# Altium schematic sheet mcu_mic_amp_connector.SchDoc
size A4
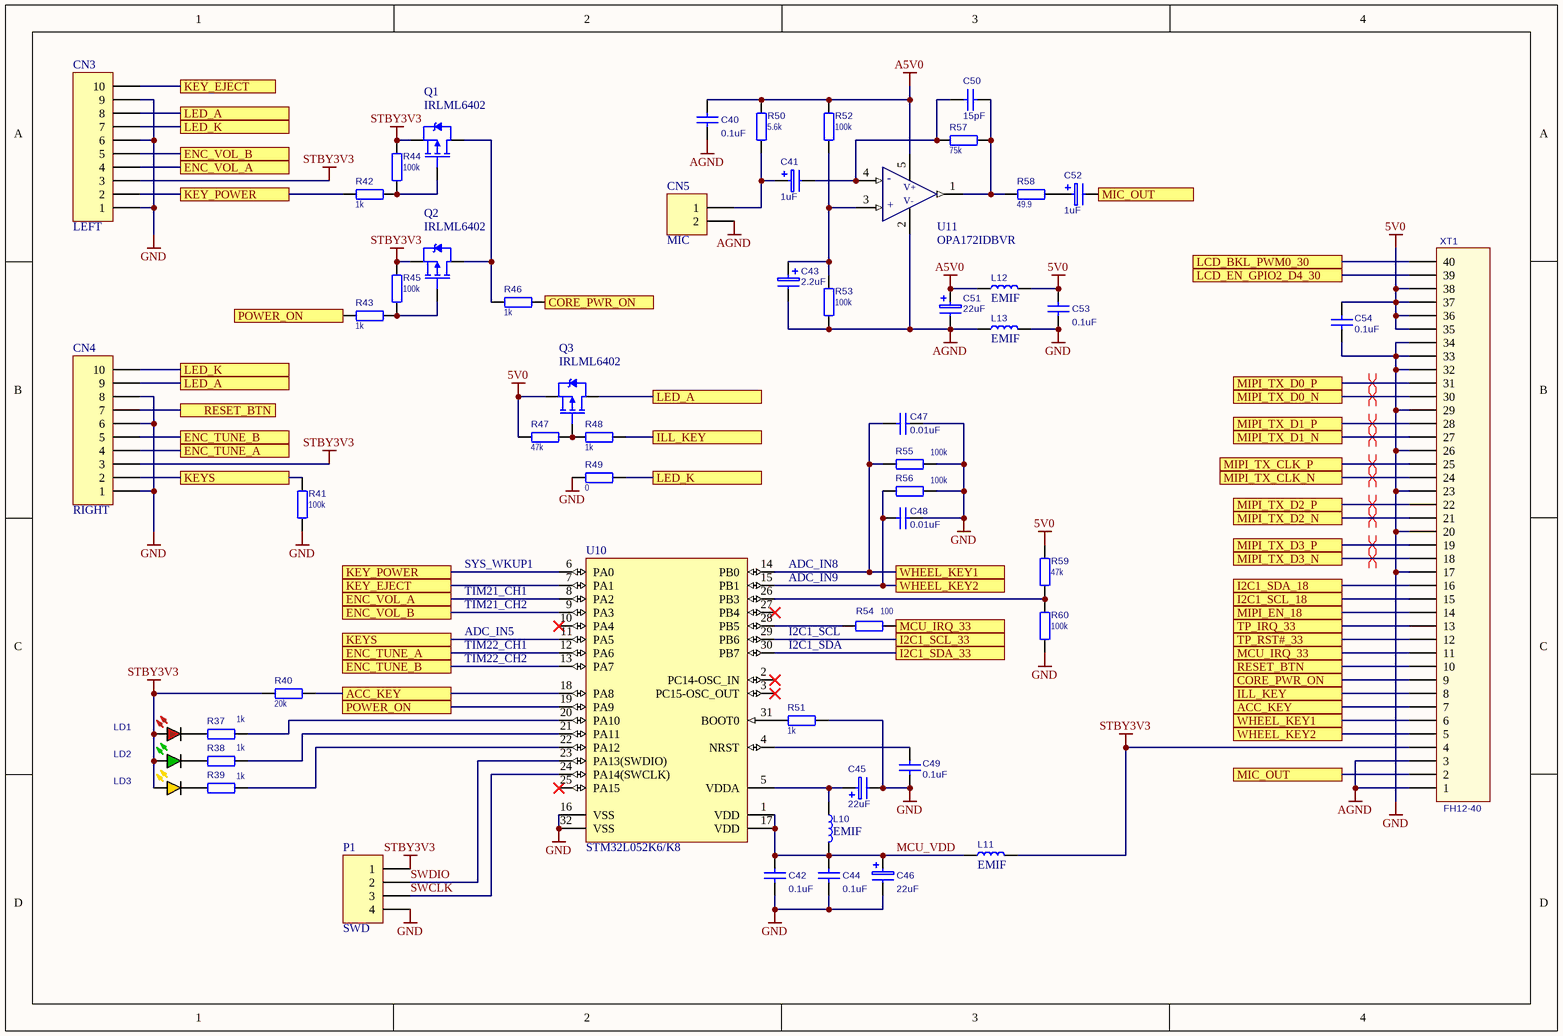
[diagram p0: mcu_mic_amp_connector.SchDoc]

## Parts
C40  value 0.1uF  [C0603]  (hidden comment: CC0603KRX7R9BB104)
C41  value 1uF  [TANTAL-A-1206]  (hidden comment: 293D105X9035A2TE3)
C42  value 0.1uF  [C0603]  (hidden comment: CC0603KRX7R9BB104)
C43  value 2.2uF  [TANTAL-A-1206]  (hidden comment: 293D225X9010A2TE3)
C44  value 0.1uF  [C0603]  (hidden comment: CC0603KRX7R9BB104)
C45  value 22uF  [TANTAL-A-1206]  (hidden comment: 293D226X9010A2TE3)
C46  value 22uF  [TANTAL-A-1206]  (hidden comment: 293D226X9010A2TE3)
C47  value 0.01uF  [C0603]  (hidden comment: CL10B103KB8NNNC)
C48  value 0.01uF  [C0603]  (hidden comment: CL10B103KB8NNNC)
C49  value 0.1uF  [C0603]  (hidden comment: CC0603KRX7R9BB104)
C50  value 15pF  [C0603]  (hidden comment: CC0603GRNPO9BN150)
C51  value 22uF  [TANTAL-A-1206]  (hidden comment: 293D226X9010A2TE3)
C52  value 1uF  [TANTAL-A-1206]  (hidden comment: 293D105X9035A2TE3)
C53  value 0.1uF  [C0603]  (hidden comment: CC0603KRX7R9BB104)
C54  value 0.1uF  [C0603]  (hidden comment: C1608X7R1H104K080AA)
CN3  LEFT  [10S-0.5SH]
CN4  RIGHT  [10S-0.5SH]
CN5  MIC  [MW-2M]
L10  value EMIF  [IND0603]  (hidden comment: BLM18AG102SN1D)
L11  value EMIF  [IND0603]  (hidden comment: BLM18AG102SN1D)
L12  value EMIF  [IND0603]  (hidden comment: BLM18AG102SN1D)
L13  value EMIF  [IND0603]  (hidden comment: BLM18AG102SN1D)
LD1  FYLS-0603URC  [LED0603]  (value not drawn)
LD2  KPT-1608SGC  [LED0603]  (value not drawn)
LD3  FYLS-0603UYC  [LED0603]  (value not drawn)
P1  SWD  [PLS-4]
Q1  IRLML6402  [SOT-23-3]
Q2  IRLML6402  [SOT-23-3]
Q3  IRLML6402  [SOT-23-3]
R37  1k  [R0603]
R38  1k  [R0603]
R39  1k  [R0603]
R40  20k  [R0603]
R41  100k  [R0603]
R42  1k  [R0603]
R43  1k  [R0603]
R44  100k  [R0603]
R45  100k  [R0603]
R46  1k  [R0603]
R47  47k  [R0603]
R48  1k  [R0603]
R49  0  [R0805]
R50  5.6k  [R0603]
R51  1k  [R0603]
R52  100k  [R0603]
R53  100k  [R0603]
R54  100  [R0603]
R55  100k  [R0603]
R56  100k  [R0603]
R57  75k  [R0603]
R58  49.9  [R0603]
R59  47k  [R0603]
R60  100k  [R0603]
U10  STM32L052K6/K8  [STM-LQFP32_N]
U11  OPA172IDBVR  [SOT-23-5]
XT1  FH12-40  [40S-0.5SH]

## Ports
ACC_KEY, CORE_PWR_ON, ENC_TUNE_A, ENC_TUNE_B, ENC_VOL_A, ENC_VOL_B, I2C1_SCL_18, I2C1_SCL_33, I2C1_SDA_18, I2C1_SDA_33, ILL_KEY, KEY_EJECT, KEY_POWER, KEYS, LCD_BKL_PWM0_30, LCD_EN_GPIO2_D4_30, LED_A, LED_K, MCU_IRQ_33, MIC_OUT, MIPI_EN_18, MIPI_TX_CLK_N, MIPI_TX_CLK_P, MIPI_TX_D0_N, MIPI_TX_D0_P, MIPI_TX_D1_N, MIPI_TX_D1_P, MIPI_TX_D2_N, MIPI_TX_D2_P, MIPI_TX_D3_N, MIPI_TX_D3_P, POWER_ON, RESET_BTN, TP_IRQ_33, TP_RST#_33, WHEEL_KEY1, WHEEL_KEY2

## Nets
5V0: C53.1 C54.2 L12.2 Q3.2(S) R47.1 R59.2 XT1.35 XT1.36 XT1.37 XT1.38
A5V0: C40.1 C51.1(+) L12.1 R50.1 R52.1 U11.5(V+)
AGND: C40.2 C43.2(-) C51.2(-) CN5.2 L13.1 R53.2 U11.2(V-) XT1.1 XT1.3
GND: C42.2 C44.2 C45.2(-) C46.2(-) C47.1 C48.1 C49.1 C53.2 C54.1 CN3.1 CN3.6 CN3.9 CN4.1 CN4.6 CN4.8 L13.2 P1.4 R41.1 R49.1 R51.2 R55.2 R56.2 R60.2 U10.16(VSS) U10.32(VSS) XT1.17 XT1.20 XT1.23 XT1.26 XT1.29 XT1.32 XT1.33 XT1.34
STBY3V3: CN3.3 CN4.3 L11.2 LD1.2 LD2.2 LD3.2 P1.1 Q1.2(S) Q2.2(S) R40.2 R44.2 R45.2 XT1.4
ACC_KEY: R40.1 U10.18(PA8) XT1.7 ; port ACC_KEY
CORE_PWR_ON: R46.1 XT1.9 ; port CORE_PWR_ON
ENC_TUNE_A: CN4.4 U10.12(PA6) ; port ENC_TUNE_A
ENC_TUNE_B: CN4.5 U10.13(PA7) ; port ENC_TUNE_B
ENC_VOL_A: CN3.4 U10.8(PA2) ; port ENC_VOL_A
ENC_VOL_B: CN3.5 U10.9(PA3) ; port ENC_VOL_B
I2C1_SCL_18: XT1.15 ; port I2C1_SCL_18
I2C1_SCL_33: U10.29(PB6) ; port I2C1_SCL_33
I2C1_SDA_18: XT1.16 ; port I2C1_SDA_18
I2C1_SDA_33: U10.30(PB7) ; port I2C1_SDA_33
ILL_KEY: R48.2 XT1.8 ; port ILL_KEY
KEY_EJECT: CN3.10 U10.7(PA1) ; port KEY_EJECT
KEY_POWER: CN3.2 R42.1 U10.6(PA0) ; port KEY_POWER
KEYS: CN4.2 R41.2 U10.11(PA5) ; port KEYS
LCD_BKL_PWM0_30: XT1.40 ; port LCD_BKL_PWM0_30
LCD_EN_GPIO2_D4_30: XT1.39 ; port LCD_EN_GPIO2_D4_30
LED_A: CN3.8 CN4.9 Q3.3(D) ; port LED_A
LED_K: CN3.7 CN4.10 R49.2 ; port LED_K
MCU_IRQ_33: R54.2 XT1.11 ; port MCU_IRQ_33
MCU_VDD: C42.1 C44.1 C46.1(+) L10.2 L11.1 U10.1(VDD) U10.17(VDD)
MIC_OUT: C52.2(-) XT1.2 ; port MIC_OUT
MIPI_EN_18: XT1.14 ; port MIPI_EN_18
MIPI_TX_CLK_N: XT1.24 ; port MIPI_TX_CLK_N
MIPI_TX_CLK_P: XT1.25 ; port MIPI_TX_CLK_P
MIPI_TX_D0_N: XT1.30 ; port MIPI_TX_D0_N
MIPI_TX_D0_P: XT1.31 ; port MIPI_TX_D0_P
MIPI_TX_D1_N: XT1.27 ; port MIPI_TX_D1_N
MIPI_TX_D1_P: XT1.28 ; port MIPI_TX_D1_P
MIPI_TX_D2_N: XT1.21 ; port MIPI_TX_D2_N
MIPI_TX_D2_P: XT1.22 ; port MIPI_TX_D2_P
MIPI_TX_D3_N: XT1.18 ; port MIPI_TX_D3_N
MIPI_TX_D3_P: XT1.19 ; port MIPI_TX_D3_P
POWER_ON: R43.2 U10.19(PA9) ; port POWER_ON
RESET_BTN: CN4.7 XT1.10 ; port RESET_BTN
SWCLK: P1.3 U10.24(PA14(SWCLK))
SWDIO: P1.2 U10.23(PA13(SWDIO))
TP_IRQ_33: XT1.13 ; port TP_IRQ_33
TP_RST#_33: XT1.12 ; port TP_RST#_33
WHEEL_KEY1: C47.2 R55.1 U10.14(PB0) XT1.6 ; port WHEEL_KEY1
WHEEL_KEY2: C48.2 R56.1 U10.15(PB1) XT1.5 ; port WHEEL_KEY2
NetC41_1: C41.1(+) CN5.1 R50.2
NetC41_2: C41.2(-) C50.1 R57.2 U11.4(-)
NetC43_1: C43.1(+) R52.2 R53.1 U11.3(+)
NetC45_1: C45.1(+) L10.1 U10.5(VDDA)
NetC49_2: C49.2 U10.4(NRST)
NetC50_2: C50.2 R57.1 R58.1 U11.1
NetC52_1: C52.1(+) R58.2
NetLD1_1: LD1.1 R37.1
NetLD2_1: LD2.1 R38.1
NetLD3_1: LD3.1 R39.1
NetQ1_1: Q1.1(G) R42.2 R44.1
NetQ1_3: Q1.3(D) Q2.3(D) R46.2
NetQ2_1: Q2.1(G) R43.1 R45.1
NetQ3_1: Q3.1(G) R47.2 R48.1
NetR37_2: R37.2 U10.20(PA10)
NetR38_2: R38.2 U10.21(PA11)
NetR39_2: R39.2 U10.22(PA12)
NetR51_1: R51.1 U10.31(BOOT0)
NetR54_1: R54.1 U10.28(PB5)
NetR59_1: R59.1 R60.1 U10.26(PB3)

Not connected (* = marked no-connect by the designer): U10 2(PC14-OSC_IN)* 3(PC15-OSC_OUT)* 10(PA4)* 25(PA15)* 27(PB4)*

## Layout directives
differential pair: MIPI_TX_CLK_N, MIPI_TX_CLK_P, MIPI_TX_D0_N, MIPI_TX_D0_P, MIPI_TX_D1_N, MIPI_TX_D1_P, MIPI_TX_D2_N, MIPI_TX_D2_P, MIPI_TX_D3_N, MIPI_TX_D3_P

## Notes on the sheet
- SYS_WKUP1
- ADC_IN9
- ADC_IN8
- TIM21_CH1
- TIM21_CH2
- TIM22_CH1
- ADC_IN5
- (near R54) I2C1_SDA
- (near R54) I2C1_SCL
- TIM22_CH2

## Library data of the parts
C40 C42 C44 C47-C50 C53 C54 = CAP_NPOL
C41 C43 C45 C46 C51 C52 = CAP_POL
CN3 CN4 = HDR 10: Header, 10-Pin; LatestRevisionDate: 17-Jul-2002; LatestRevisionNote: Re-released for DXP Platform.; Publisher: Altium Limited
CN5 = HDR 2: Header, 2-Pin; value: MW-2MR; LatestRevisionDate: 17-Jul-2002; LatestRevisionNote: Re-released for DXP Platform.; Publisher: Altium Limited
L10-L13 = IND_WO_IRON
LD1 = LED_RED: LED Red; Value: *
LD2 = LED_GREEN: LED Green; Value: *
LD3 = LED_YELLOW: LED Yellow; Value: *
P1 = HDR 4: Header, 4-Pin; LatestRevisionDate: 17-Jul-2002; LatestRevisionNote: Re-released for DXP Platform.; Publisher: Altium Limited
Q1-Q3 = P-Channel: HEXFET Power MOSFET
R37-R60 = RESISTOR: RES
  R37-R39 R42 R43 R46 R48 R51: Value: 1k
  R40: Value: 20k
  R41 R44 R45 R52 R53 R55 R56 R60: Value: 100k
  R47 R59: Value: 47k
  R49: Value: 0
  R50: Value: 5.6k
  R54: Value: 100
  R57: Value: 75k
  R58: Value: 49.9
U10 = STM32L052K6/K8: Ultra-low power ARM Cortex-M0+ MCU with 64 Kbytes Flash, 32 MHz CPU, USB; PartNumber: STM32F050F6P7; FLASH Size (Prog) (kB): 32; I/Os (High Current): 15; Internal RAM Size (kB): 4; Operating Frequency(F) (Processor speed) (MHz): 48; Packing: Tube; Supply Voltage(Vcc) min (V): 2; DatasheetVersion: Rev. 1; PackageVersion: Rev. 1, 11/2012; PackageReference: TSSOP20; PackageDescription: 20-Pin Thin Shrink Small Outline Package, 6.5 x 4.4 mm Body, 0.65 mm Pitch; Supplier 1: Newark; Supplier Part Number 1: 19X6195; Supplier 2: Mouser; Supplier Part Number 2: 511-STM32F050F6P7; Core: ARM Cortex-M0; Mounting Technology: Surface Mount; ComponentLink1Description: Manufacturer URL; ComponentLink1URL: http://www.st.com/web/en/home.html; ComponentLink2Description: Datasheet; ComponentLink2URL: http://www.st.com/st-web-ui/static/active/en/resource/technical/document/datasheet/DM00065136.pdf; ComponentLink3Description: Package Specification; ComponentLink3URL: http://www.st.com/st-web-ui/static/active/en/resource/technical/document/datasheet/DM00065136.pdf
U11 = OPA172IDBVR: OPAx172 36-V, Single-Supply, 10-MHz, Rail-to-Rail Output Operational Amplifiers; value: OPA172IDBVR
XT1 = FH12-40: DT38; Value: *